# Altium schematic sheet IO模組_MCP23017_20240819.SchDoc
size A4
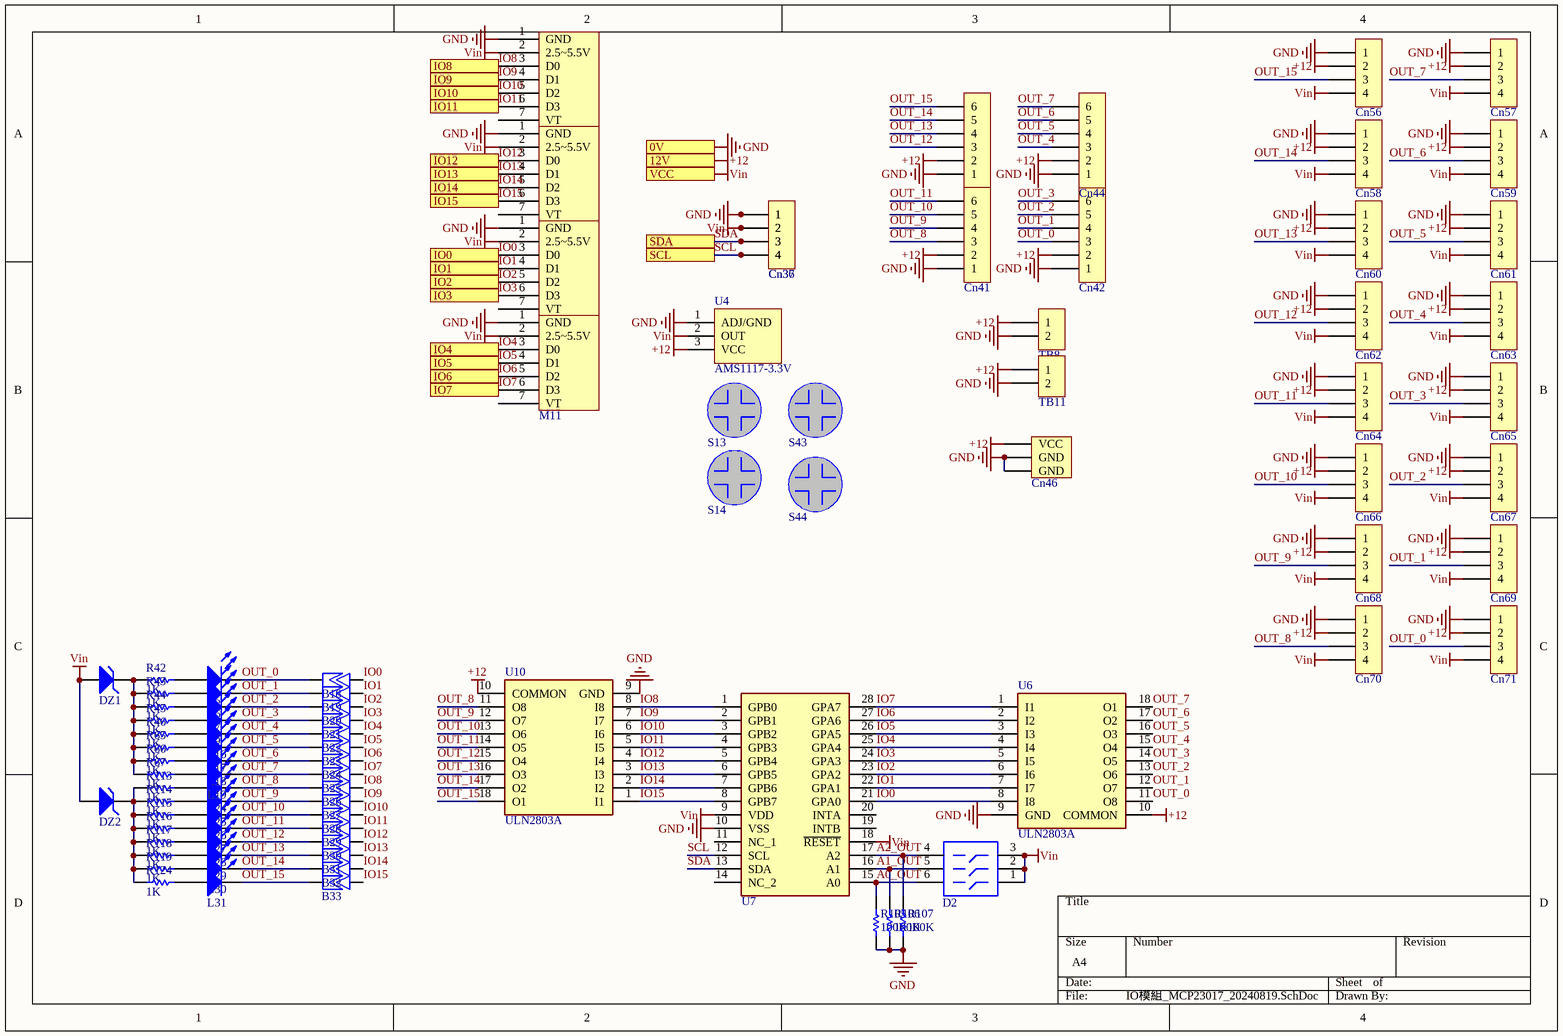
[diagram p0: IO模組_MCP23017_20240819.SchDoc]

## Parts
B18  短路  [BYPASS-0805]  (value not drawn)
B19  短路  [BYPASS-0805]  (value not drawn)
B20  短路  [BYPASS-0805]  (value not drawn)
B21  短路  [BYPASS-0805]  (value not drawn)
B22  短路  [BYPASS-0805]  (value not drawn)
B23  短路  [BYPASS-0805]  (value not drawn)
B24  短路  [BYPASS-0805]  (value not drawn)
B25  短路  [BYPASS-0805]  (value not drawn)
B26  短路  [BYPASS-0805]  (value not drawn)
B27  短路  [BYPASS-0805]  (value not drawn)
B28  短路  [BYPASS-0805]  (value not drawn)
B29  短路  [BYPASS-0805]  (value not drawn)
B30  短路  [BYPASS-0805]  (value not drawn)
B31  短路  [BYPASS-0805]  (value not drawn)
B32  短路  [BYPASS-0805]  (value not drawn)
B33  短路  [BYPASS-0805]  (value not drawn)
Cn36  KF2510  [Connector_KF2510-4A]  (value not drawn)
Cn37  KF2510  [Connector_KF2510-4A]  (value not drawn)
Cn39  KF2510-6  [Connector_KF2510-6W]  (value not drawn)
Cn41  KF2510-6  [Connector_KF2510-6W]  (value not drawn)
Cn42  KF2510-6  [Connector_KF2510-6W]  (value not drawn)
Cn44  KF2510-6  [Connector_KF2510-6W]  (value not drawn)
Cn46  KF2510-4  [Connector_DC-005]  (value not drawn)
Cn56  KF2510  [Connector_KF2510-4A]  (value not drawn)
Cn57  KF2510  [Connector_KF2510-4A]  (value not drawn)
Cn58  KF2510  [Connector_KF2510-4A]  (value not drawn)
Cn59  KF2510  [Connector_KF2510-4A]  (value not drawn)
Cn60  KF2510  [Connector_KF2510-4A]  (value not drawn)
Cn61  KF2510  [Connector_KF2510-4A]  (value not drawn)
Cn62  KF2510  [Connector_KF2510-4A]  (value not drawn)
Cn63  KF2510  [Connector_KF2510-4A]  (value not drawn)
Cn64  KF2510  [Connector_KF2510-4A]  (value not drawn)
Cn65  KF2510  [Connector_KF2510-4A]  (value not drawn)
Cn66  KF2510  [Connector_KF2510-4A]  (value not drawn)
Cn67  KF2510  [Connector_KF2510-4A]  (value not drawn)
Cn68  KF2510  [Connector_KF2510-4A]  (value not drawn)
Cn69  KF2510  [Connector_KF2510-4A]  (value not drawn)
Cn70  KF2510  [Connector_KF2510-4A]  (value not drawn)
Cn71  KF2510  [Connector_KF2510-4A]  (value not drawn)
D2  KE 撥碼開關 1.27mm  [Switch_Dip-3]  (value not drawn)
DZ1  12V1  [Diode_1/4]  (value not drawn)
DZ2  12V1  [Diode_1/4]  (value not drawn)
L5  藍  [LED-1206]  (value not drawn)
L6  藍  [LED-1206]  (value not drawn)
L7  藍  [LED-1206]  (value not drawn)
L9  藍  [LED-1206]  (value not drawn)
L16  藍  [LED-1206]  (value not drawn)
L17  藍  [LED-1206]  (value not drawn)
L18  藍  [LED-1206]  (value not drawn)
L19  藍  [LED-1206]  (value not drawn)
L24  藍  [LED-1206]  (value not drawn)
L25  藍  [LED-1206]  (value not drawn)
L26  藍  [LED-1206]  (value not drawn)
L27  藍  [LED-1206]  (value not drawn)
L28  藍  [LED-1206]  (value not drawn)
L29  藍  [LED-1206]  (value not drawn)
L30  藍  [LED-1206]  (value not drawn)
L31  藍  [LED-1206]  (value not drawn)
M8  XR390  [XR390 Module]  (value not drawn)
M9  XR390  [XR390 Module]  (value not drawn)
M10  XR390  [XR390 Module]  (value not drawn)
M11  XR390  [XR390 Module]  (value not drawn)
R42  1K  [Res-1206]
R43  1K  [Res-1206]
R44  1K  [Res-1206]
R45  1K  [Res-1206]
R46  1K  [Res-1206]
R65  1K  [Res-1206]
R66  1K  [Res-1206]
R67  1K  [Res-1206]
R105  100K  [Res-1206]
R106  100K  [Res-1206]
R107  100K  [Res-1206]
R113  1K  [Res-1206]
R114  1K  [Res-1206]
R115  1K  [Res-1206]
R116  1K  [Res-1206]
R117  1K  [Res-1206]
R118  1K  [Res-1206]
R119  1K  [Res-1206]
R124  1K  [Res-1206]
S13  M3  [Screw M3]  (value not drawn)
S14  M3  [Screw M3]  (value not drawn)
S43  M3  [Screw M3]  (value not drawn)
S44  M3  [Screw M3]  (value not drawn)
TB8  KF2EDG5.08_2P  [Terminal block(KF2EDGR-5.08 _2P)]  (value not drawn)
TB11  KF2EDG5.08_2P  [Terminal block(KF2EDGR-5.08 _2P)]  (value not drawn)
U4  AMS1117-3.3V  [SOT 223]
U6  ULN2803A  [DIP-18]
U7  MCP23017  [DIP-28]  (value not drawn)
U10  ULN2803A  [DIP-18]

## Ports
0V, 12V, IO0, IO1, IO2, IO3, IO4, IO5, IO6, IO7, IO8, IO9, IO10, IO11, IO12, IO13, IO14, IO15, SCL, SDA, VCC

## Nets
+12: Cn39.2 Cn41.2 Cn42.2 Cn44.2 Cn46.1(VCC) Cn56.2 Cn57.2 Cn58.2 Cn59.2 Cn60.2 Cn61.2 Cn62.2 Cn63.2 Cn64.2 Cn65.2 Cn66.2 Cn67.2 Cn68.2 Cn69.2 Cn70.2 Cn71.2 TB8.1 TB11.1 U4.3(VCC) U6.10(COMMON) U10.10(COMMON) ; port 12V
GND: Cn36.1 Cn37.1 Cn39.1 Cn41.1 Cn42.1 Cn44.1 Cn46.2(GND) Cn46.3(GND) Cn56.1 Cn57.1 Cn58.1 Cn59.1 Cn60.1 Cn61.1 Cn62.1 Cn63.1 Cn64.1 Cn65.1 Cn66.1 Cn67.1 Cn68.1 Cn69.1 Cn70.1 Cn71.1 M8.1(GND) M9.1(GND) M10.1(GND) M11.1(GND) R105.1 R106.1 R107.1 TB8.2 TB11.2 U4.1(ADJ/GND) U6.9(GND) U7.10(VSS) U10.9(GND) ; port 0V
Vin: Cn36.2 Cn37.2 Cn56.4 Cn57.4 Cn58.4 Cn59.4 Cn60.4 Cn61.4 Cn62.4 Cn63.4 Cn64.4 Cn65.4 Cn66.4 Cn67.4 Cn68.4 Cn69.4 Cn70.4 Cn71.4 D2.1 D2.2 D2.3 DZ1.2(A) DZ2.2(A) M8.2(2.5~5.5V) M9.2(2.5~5.5V) M10.2(2.5~5.5V) M11.2(2.5~5.5V) U4.2(OUT) U7.9(VDD) U7.18(~{RESET}) ; port VCC
A0_OUT: D2.6 R105.2 U7.15(A0)
A1_OUT: D2.5 R106.2 U7.16(A1)
A2_OUT: D2.4 R107.2 U7.17(A2)
IO0: B18.2 M10.3(D0) U6.8(I8) U7.21(GPA0) ; port IO0
IO1: B19.2 M10.4(D1) U6.7(I7) U7.22(GPA1) ; port IO1
IO2: B20.2 M10.5(D2) U6.6(I6) U7.23(GPA2) ; port IO2
IO3: B21.2 M10.6(D3) U6.5(I5) U7.24(GPA3) ; port IO3
IO4: B22.2 M11.3(D0) U6.4(I4) U7.25(GPA4) ; port IO4
IO5: B23.2 M11.4(D1) U6.3(I3) U7.26(GPA5) ; port IO5
IO6: B24.2 M11.5(D2) U6.2(I2) U7.27(GPA6) ; port IO6
IO7: B25.2 M11.6(D3) U6.1(I1) U7.28(GPA7) ; port IO7
IO8: B26.2 M8.3(D0) U7.1(GPB0) U10.8(I8) ; port IO8
IO9: B27.2 M8.4(D1) U7.2(GPB1) U10.7(I7) ; port IO9
IO10: B28.2 M8.5(D2) U7.3(GPB2) U10.6(I6) ; port IO10
IO11: B29.2 M8.6(D3) U7.4(GPB3) U10.5(I5) ; port IO11
IO12: B30.2 M9.3(D0) U7.5(GPB4) U10.4(I4) ; port IO12
IO13: B31.2 M9.4(D1) U7.6(GPB5) U10.3(I3) ; port IO13
IO14: B32.2 M9.5(D2) U7.7(GPB6) U10.2(I2) ; port IO14
IO15: B33.2 M9.6(D3) U7.8(GPB7) U10.1(I1) ; port IO15
OUT_0: B18.1 Cn42.3 Cn71.3 L5.1(K) U6.11(O8)
OUT_1: B19.1 Cn42.4 Cn69.3 L6.1(K) U6.12(O7)
OUT_2: B20.1 Cn42.5 Cn67.3 L7.1(K) U6.13(O6)
OUT_3: B21.1 Cn42.6 Cn65.3 L9.1(K) U6.14(O5)
OUT_4: B22.1 Cn44.3 Cn63.3 L16.1(K) U6.15(O4)
OUT_5: B23.1 Cn44.4 Cn61.3 L17.1(K) U6.16(O3)
OUT_6: B24.1 Cn44.5 Cn59.3 L18.1(K) U6.17(O2)
OUT_7: B25.1 Cn44.6 Cn57.3 L19.1(K) U6.18(O1)
OUT_8: B26.1 Cn41.3 Cn70.3 L24.1(K) U10.11(O8)
OUT_9: B27.1 Cn41.4 Cn68.3 L25.1(K) U10.12(O7)
OUT_10: B28.1 Cn41.5 Cn66.3 L26.1(K) U10.13(O6)
OUT_11: B29.1 Cn41.6 Cn64.3 L27.1(K) U10.14(O5)
OUT_12: B30.1 Cn39.3 Cn62.3 L28.1(K) U10.15(O4)
OUT_13: B31.1 Cn39.4 Cn60.3 L29.1(K) U10.16(O3)
OUT_14: B32.1 Cn39.5 Cn58.3 L30.1(K) U10.17(O2)
OUT_15: B33.1 Cn39.6 Cn56.3 L31.1(K) U10.18(O1)
SCL: Cn36.4 Cn37.4 U7.12(SCL) ; port SCL
SDA: Cn36.3 Cn37.3 U7.13(SDA) ; port SDA
NetDZ1_1: DZ1.1(K) R42.2 R43.2 R44.2 R45.2 R46.2 R65.2 R66.2 R67.2
NetDZ2_1: DZ2.1(K) R113.2 R114.2 R115.2 R116.2 R117.2 R118.2 R119.2 R124.2
NetL5_2: L5.2(A) R42.1
NetL6_2: L6.2(A) R43.1
NetL7_2: L7.2(A) R44.1
NetL9_2: L9.2(A) R45.1
NetL16_2: L16.2(A) R46.1
NetL17_2: L17.2(A) R65.1
NetL18_2: L18.2(A) R66.1
NetL19_2: L19.2(A) R67.1
NetL24_2: L24.2(A) R113.1
NetL25_2: L25.2(A) R114.1
NetL26_2: L26.2(A) R115.1
NetL27_2: L27.2(A) R116.1
NetL28_2: L28.2(A) R117.1
NetL29_2: L29.2(A) R118.1
NetL30_2: L30.2(A) R119.1
NetL31_2: L31.2(A) R124.1

Not connected (* = marked no-connect by the designer): M8 7(VT); M9 7(VT); M10 7(VT); M11 7(VT); U7 11(NC_1) 14(NC_2) 19(INTB) 20(INTA)

## Library data of the parts
B18-B33 = Bypass: 短路焊點(如標註短路則需額外補錫使其短路)
Cn36 Cn37 Cn56-Cn71 = Contact(4P): 接線端子
Cn39 Cn41 Cn42 Cn44 = Contact(6P): 接線端子
Cn46 = Contact_DC: 接線端子
D2 = Switch_Dip _3: 開關_撥碼_3位
DZ1 DZ2 = Diode_Zener: 二極體_稽納
L5-L7 L9 L16-L19 L24-L31 = LED
M8-M11 = XR390: 遙控器模組
R42-R46 R65-R67 R105-R107 R113-R119 R124 = Res: 電阻
S13 S14 S43 S44 = Screw: 螺絲(非焊接元件)
TB8 TB11 = Terminal block(2P): 端子台
U4 = AMS1117: 降壓IC,LOD
U6 U10 = TBD62083A: 閘極驅動器 P型 50V 0.5A; Manufacturer_Name: Toshiba; Manufacturer_Part_Number: TBD62083AFNG,EL; Geometry.Height: 1.55mm; Mouser Part Number: 757-TBD60183AFNGEL; Mouser Price/Stock: https://www.mouser.co.uk/ProductDetail/Toshiba/TBD62183AFNGEL?qs=lYGu3FyN48dJ%2FQ%2FqZoTqjQ%3D%3D; Datasheet Link: chrome-extension://efaidnbmnnnibpcajpcglclefindmkaj/https://www.mouser.tw/datasheet/2/408/TBD62083AFWG_datasheet_en_20160511-769679.pdf; ComponentLink1Description: datasheet; ComponentLink1URL: https://www.mouser.tw/datasheet/2/408/TBD62083AFNG_datasheet_en_20160511-769697.pdf
U7 = MCP23017: I2C IO; Manufacturer_Name: Microchip; Manufacturer_Part_Number: MCP23017-E/SO; Height: 2.65mm; ComponentLink1Description: datasheet; ComponentLink1URL: https://ww1.microchip.com/downloads/en/devicedoc/20001952c.pdf